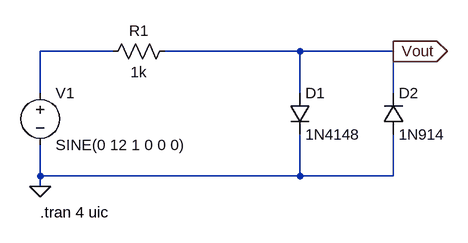
[diagram p0: schematic ALTLED.asc]
ALTLED.asc, the LTspice schematic file:
Version 4.1
SHEET 1 880 680
WIRE 96 64 -16 64
WIRE 384 64 176 64
WIRE 528 64 384 64
WIRE -16 128 -16 64
WIRE 384 128 384 64
WIRE 528 128 528 64
WIRE -16 256 -16 208
WIRE 384 256 384 192
WIRE 384 256 -16 256
WIRE 528 256 528 192
WIRE 528 256 384 256
WIRE -16 272 -16 256
FLAG -16 272 0
FLAG 528 64 Vout
IOPIN 528 64 Out
SYMBOL voltage -16 112 R0
WINDOW 123 0 0 Left 0
WINDOW 39 0 0 Left 0
SYMATTR InstName V1
SYMATTR Value SINE(0 12 1 0 0 0)
SYMBOL res 192 48 R90
WINDOW 0 0 56 VBottom 2
WINDOW 3 32 56 VTop 2
SYMATTR InstName R1
SYMATTR Value 1k
SYMBOL diode 368 128 R0
SYMATTR InstName D1
SYMATTR Value 1N4148
SYMBOL diode 512 192 M180
WINDOW 0 24 64 Left 2
WINDOW 3 24 0 Left 2
SYMATTR InstName D2
SYMATTR Value 1N914
TEXT -16 312 Left 2 !.tran 4 uic

The netlist it stands for:
* ALTLED.asc
V1 N001 0 SINE(0 12 1 0 0 0)
R1 Vout N001 1k
D1 Vout 0 1N4148
D2 0 Vout 1N914
.model D D
.lib standard.dio
.tran 4 uic
.backanno
.end